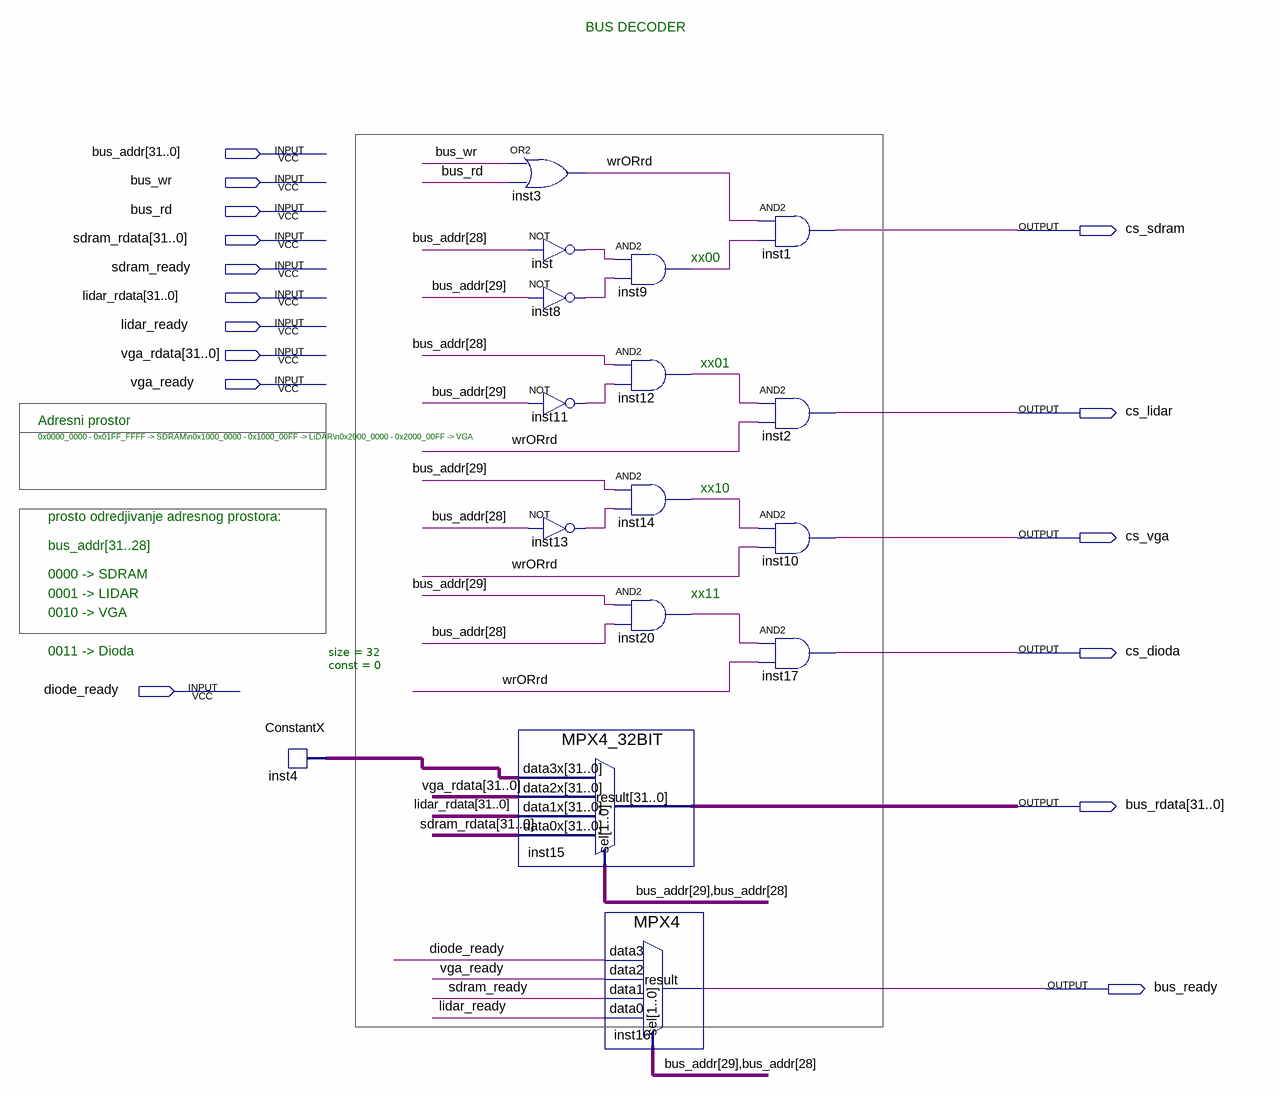
[diagram p0: schematic sheet]
// Quartus schematic BusDecoderDiodTest.bdf as structural Verilog: 16 symbols, 16 pins
module BusDecoderDiodTest (
  input  [31:0] bus_addr,
  input  bus_wr,
  input  bus_rd,
  input  [31:0] sdram_rdata,
  input  sdram_ready,
  input  [31:0] lidar_rdata,
  input  lidar_ready,
  input  [31:0] vga_rdata,
  input  vga_ready,
  input  diode_ready,
  output cs_sdram,
  output cs_lidar,
  output cs_vga,
  output cs_dioda,
  output [31:0] bus_rdata,
  output bus_ready
);

  wire inst8_out, inst9_out, inst11_out, inst12_out, inst13_out, inst14_out, inst20_out, inst_out, wrORrd;
  wire [31:0] inst4_data_out;

  ConstantX #(.size(32), .\const (0)) inst4 (.DATA_OUT(inst4_data_out));
  or inst3 (wrORrd, bus_wr, bus_rd);
  not inst (inst_out, bus_addr[28]);
  not inst8 (inst8_out, bus_addr[29]);
  not inst11 (inst11_out, bus_addr[29]);
  not inst13 (inst13_out, bus_addr[28]);
  MPX4_32BIT inst15 (
    .data3x(inst4_data_out), .data2x(vga_rdata), .data1x(lidar_rdata), .data0x(sdram_rdata),
    .sel(bus_addr[29:28]), .result(bus_rdata));
  and inst9 (inst9_out, inst_out, inst8_out);
  and inst12 (inst12_out, bus_addr[28], inst11_out);
  and inst14 (inst14_out, bus_addr[29], inst13_out);
  and inst20 (inst20_out, bus_addr[29], bus_addr[28]);
  MPX4 inst16 (
    .data3(diode_ready), .data2(vga_ready), .data1(sdram_ready), .data0(lidar_ready), .sel(bus_addr[29:28]),
    .result(bus_ready));
  and inst1 (cs_sdram, wrORrd, inst9_out);
  and inst2 (cs_lidar, inst12_out, wrORrd);
  and inst10 (cs_vga, inst14_out, wrORrd);
  and inst17 (cs_dioda, inst20_out, wrORrd);

  // Notes on the sheet:
  //   BUS DECODER
  //   xx00
  //   xx01
  //   Adresni prostor
  //   0x0000_0000 - 0x01FF_FFFF -> SDRAM\n0x1000_0000 - 0x1000_00FF -> LiDAR\n0x2000_0000 - 0x2000_00FF -> VGA
  //   xx10
  //   prosto odredjivanje adresnog prostora:
  //   bus_addr[31..28]
  //   0000 -> SDRAM
  //   0001 -> LIDAR
  //   xx11
  //   0010 -> VGA
  //   0011 -> Dioda
endmodule
